# Altium schematic sheet Sheet1.SchDoc
size A4
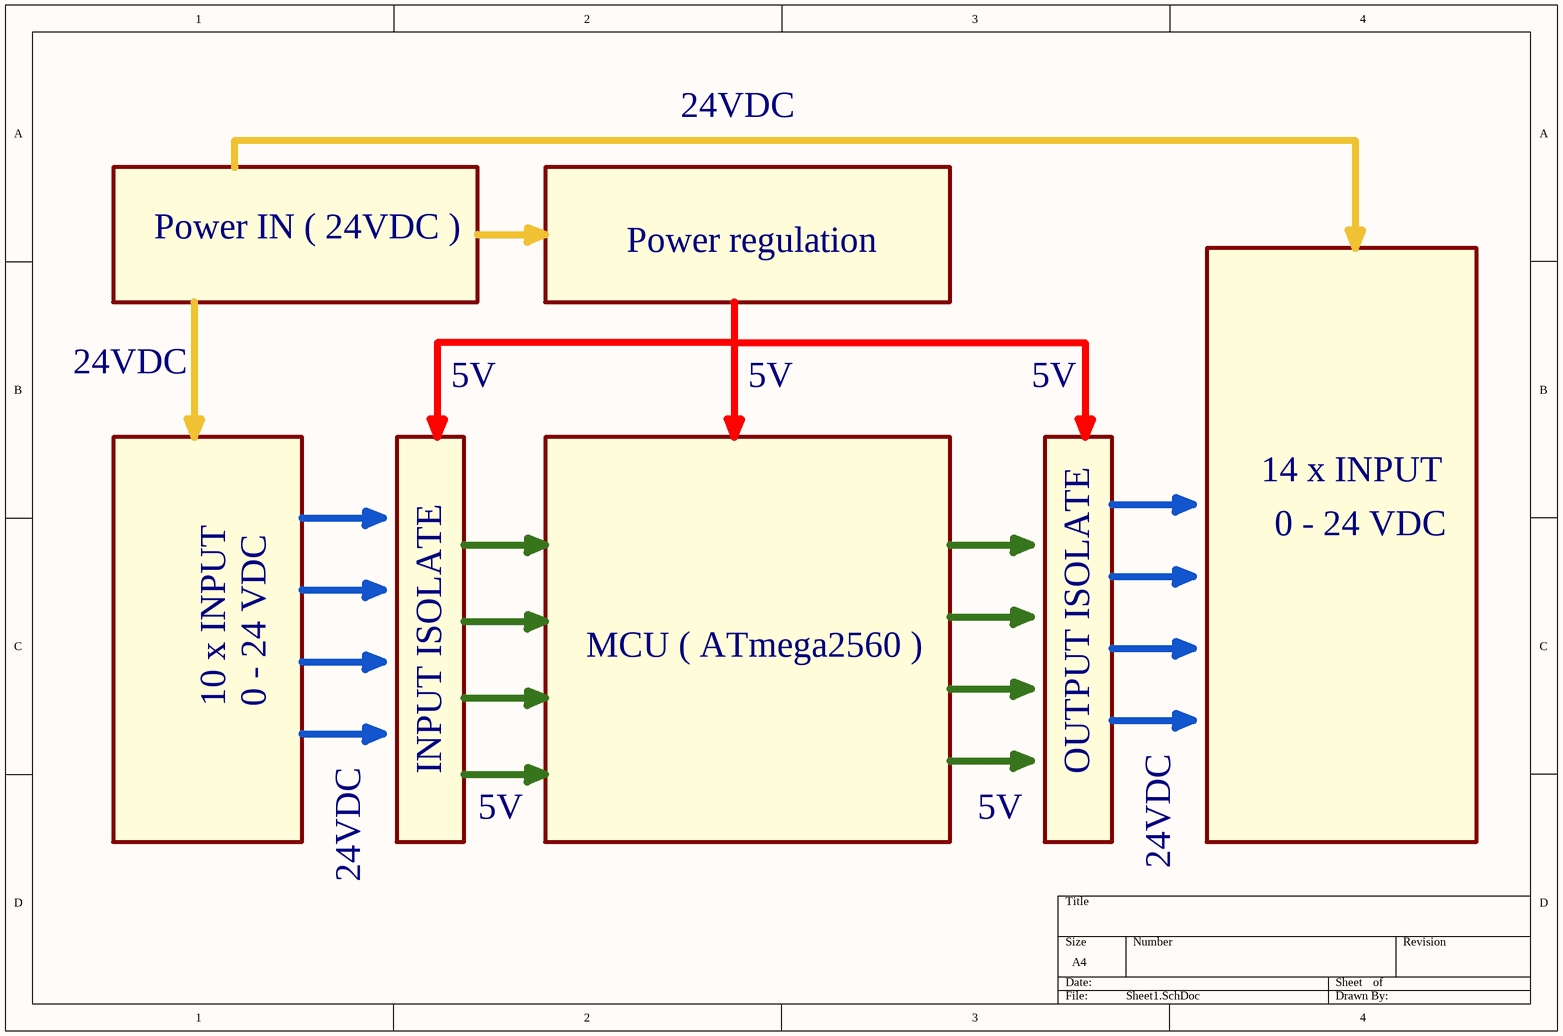
[diagram p0: Sheet1.SchDoc]

## Notes on the sheet
- 24VDC
- Power IN ( 24VDC )
- Power regulation
- 5V
- 14 x INPUT
- 0 - 24 VDC
- 10 x INPUT
- MCU ( ATmega2560 )
- INPUT ISOLATE
- OUTPUT ISOLATE